# Altium schematic sheet MXChip.SchDoc
size A4; SheetNumber: 2; SheetTotal: 2
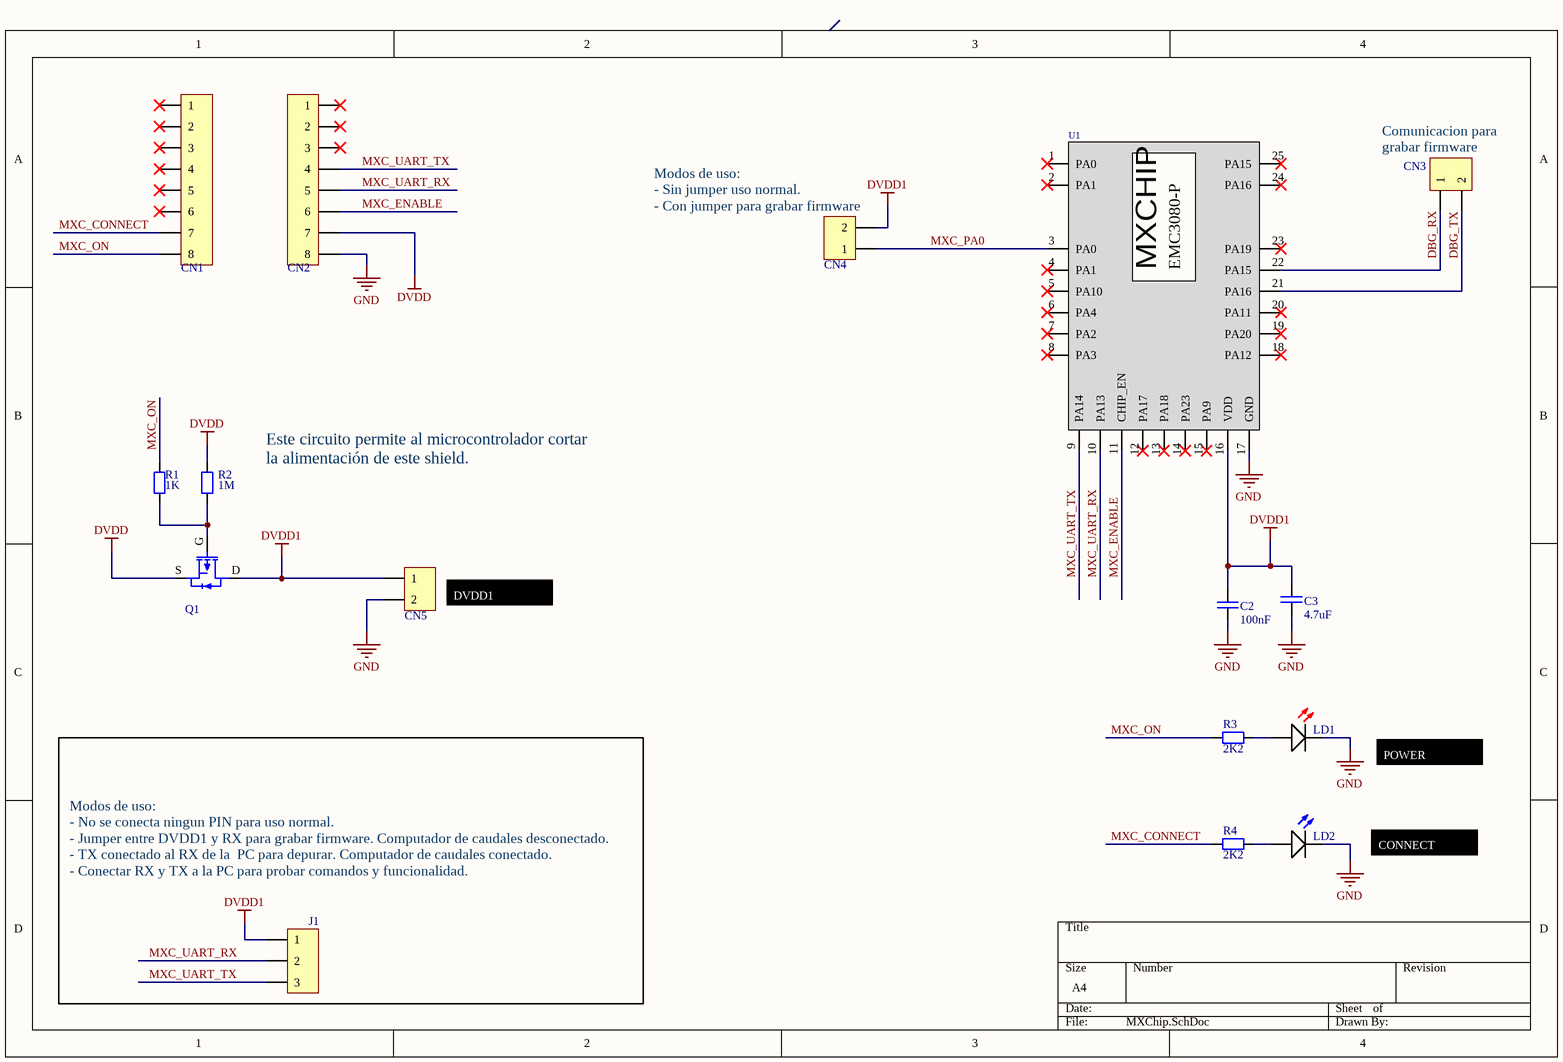
[diagram p0: MXChip.SchDoc]

## Parts
C2  100nF  [CAP_SM0805_YAGEOCC2_N]
C3  4.7uF  [CAP_SM0805_YAGEOCC2_N]
CN1  DEALON DZ200R-11-08-39  [HEADER PIN 1X8 2mm]  (value not drawn)
CN2  DEALON DZ200R-11-08-39  [HEADER PIN 1X8 2mm]  (value not drawn)
CN3  Completar BOM con modelo 54101-T0600LF (o equivalente), es de 36 posiciones, este componente necesita cortar 2 por componente  [HEADER PIN 1X2]  (value not drawn)
CN4  Completar BOM con modelo 54101-T0600LF (o equivalente), es de 36 posiciones, este componente necesita cortar 2 por componente  [HEADER PIN 1X2]  (value not drawn)
CN5  Completar BOM con modelo 54101-T0600LF (o equivalente), es de 36 posiciones, este componente necesita cortar 2 por componente  [HEADER PIN 1X2]  (value not drawn)
J1  Completar BOM con modelo 54101-T0600LF (o equivalente), es de 36 posiciones, este componente necesita cortar 3 por componente  [HEADER PIN 1X3]  (value not drawn)
LD1  ERROR  [LED 0805]  (value not drawn)
LD2  RUN  [LED 0805]  (value not drawn)
Q1  DMG3401LSN-7  [DMG3401LSN-7]  (value not drawn)
R1  1K  [RES_SM0805_YAGEORC_N]
R2  1M  [RES_SM0805_YAGEORC_N]
R3  2K2  [RES_SM0805_YAGEORC_N]
R4  2K2  [RES_SM0805_YAGEORC_N]
U1  EMC3080-P  [EMC3080-P]  (value not drawn)

## Nets
DVDD: CN2.7 Q1.S R2.2
DVDD1: C2.1 C3.1 CN4.2 CN5.1 J1.1 Q1.D U1.16(VDD)
GND: C2.2 C3.2 CN2.8 CN5.2 LD1.K LD2.K U1.17(GND)
DBG_RX: CN3.1 U1.22(PA15)
DBG_TX: CN3.2 U1.21(PA16)
MXC_CONNECT: CN1.7 R4.1
MXC_ENABLE: CN2.6 U1.11(CHIP_EN)
MXC_ON: CN1.8 R1.2 R3.1
MXC_PA0: CN4.1 U1.3(PA0)
MXC_UART_RX: CN2.5 J1.2 U1.10(PA13)
MXC_UART_TX: CN2.4 J1.3 U1.9(PA14)
NetLD1_A: LD1.A R3.2
NetLD2_A: LD2.A R4.2
NetQ1_G: Q1.G R1.1 R2.1

Not connected (* = marked no-connect by the designer): CN1 1* 2* 3* 4* 5* 6*; CN2 1* 2* 3*; U1 1(PA0)* 2(PA1)* 4(PA1)* 5(PA10)* 6(PA4)* 7(PA2)* 8(PA3)* 12(PA17)* 13(PA18)* 14(PA23)* 15(PA9)* 18(PA12)* 19(PA20)* 20(PA11)* 23(PA19)* 24(PA16)* 25(PA15)*

## Notes on the sheet
- (near CN3) Comunicacion para grabar firmware
- (near CN4) Modos de uso:
  - Sin jumper uso normal.
  - Con jumper para grabar firmware
- Este circuito permite al microcontrolador cortar la alimentación de este shield.
- (near CN5) DVDD1
- POWER
- Modos de uso:
  - No se conecta ningun PIN para uso normal.
  - Jumper entre DVDD1 y RX para grabar firmware. Computador de caudales desconectado.
  - TX conectado al RX de la  PC para depurar. Computador de caudales conectado.
  - Conectar RX y TX a la PC para probar comandos y funcionalidad.
- CONNECT

## Library data of the parts
C2 = CC0805KRX7R8BB104: CAP 100nF SM0805 X7R 25V YAGEO CC2; Tolerance (%): 10; Voltage Rating (Volts): 25; Category: Capacitor; Manufacturer: Yageo; Manufacturer Part Number: CC0805KRX7R8BB104; Package: 0805; Value: 100nF; Supplier Part Number 1: 644249; Supplier 1: Farnell; ComponentLink1URL: http://www.yageo.com; ComponentLink1Description: Manufacturer Website; Supplier 2: Digi-Key; Supplier Part Number 2: 311-1141-1-ND
C3 = CC0805KRX5R6BB475: CAP 4.7uF SM0805 X5R 10V YAGEO CC2; Tolerance (%): 10; Category: Capacitor; Manufacturer: Yageo; Manufacturer Part Number: CC0805KRX5R6BB475; Package: 0805; Value: 4.7uF; Supplier Part Number 1: 718671; Supplier 1: Farnell; ComponentLink1URL: http://www.yageo.com; ComponentLink1Description: Manufacturer Website; Voltage Rating (Volts): 10; Supplier 2: Digi-Key; Supplier Part Number 2: 311-1374-1-ND; Datasheet: https://datasheet.lcsc.com/lcsc/2304140030_YAGEO-CC0805KRX5R6BB475_C605218.pdf
CN1 CN2 = DEALON DZ200R-11-08-39: 1 x 8 - true hole  2mm - Pb free; Manufacturer: Amphenol ICC; Manufacturer Part Number: DZ200R-11-08-39; Category: Header pin; Datasheet: https://datasheet.lcsc.com/lcsc/2202082130_Amphenol-ICC-54101-T06-00_C213463.pdf; Temperature Max: 125; Temperature Min: -65
CN3-CN5 = 54101-T0600LF-CUT-2: 1 x 2 - true hole  2.54mm - Pb free; Manufacturer: Amphenol ICC; Equivalente: B-2100S02P-A110; Category: Header pin; Datasheet: https://datasheet.lcsc.com/lcsc/2202082130_Amphenol-ICC-54101-T06-00_C213463.pdf; Temperature Max: 125; Temperature Min: -65
J1 = 54101-T0600LF-CUT-3: 1 x 3 - true hole  2.54mm - Pb free; Manufacturer: Amphenol ICC; Manufacturer Part Number: 54101-T0600LF; Category: Header pin; Datasheet: https://datasheet.lcsc.com/lcsc/2202082130_Amphenol-ICC-54101-T06-00_C213463.pdf; Temperature Max: 125; Temperature Min: -65
LD1 = 17-21SURC/S530-A2/TR8: Manufacturer: Everlight Elec; Manufacturer Part Number: 17-21SURC/S530-A2/TR8; Category: LED; Main supplier: LCSC
LD2 = 17-21/BHC-XL2M2TY/3T: Manufacturer: Everlight Elec; Manufacturer Part Number: 17-21/BHC-XL2M2TY; Category: LED; Datasheet: https://datasheet.lcsc.com/lcsc/1809192317_Everlight-Elec-17-21-BHC-XL2M2TY-3T_C72035.pdf; Temperature Max: 85; Temperature Min: -40; Main supplier: LCSC
Q1 = DMG3401LSN-7: P-CHANNEL ENHANCEMENT MODE MOSFET / RDS(ON) = 85mΩ @ VGS = -2.5V -> ID -2.7A / V(BR)DDS 30V; Manufacturer: Diodes Incorporated; Category: Transistor mosfet; Manufacturer Part Number: DMG3401LSN-7; Datasheet: https://www.digikey.com/es/products/detail/diodes-incorporated/DMG3401LSN-7/3720138?s=N4IgTCBcDaICIFkDiBmALABgIwBkDKAcgLQDsIAugL5A
R1 = RC0805FR-071KL: RES 1K SM0805 YAGEO RC_L; Power (Watts): 0.125; Resistance (Ohms): 1000; Tolerance (%): 1; Category: Resistor; Manufacturer: Yageo; Manufacturer Part Number: RC0805FR-071KL; Package: 0805; Value: 1K; Supplier Part Number 1: 9237496; Supplier 1: Farnell; ComponentLink1URL: http://www.yageo.com; ComponentLink1Description: Manufacturer Website; Supplier 2: Digi-Key; Supplier Part Number 2: 311-1.00KCRCT-ND; Datasheet: https://www.yageo.com/upload/media/product/app/datasheet/rchip/pyu-rc_group_51_rohs_l.pdf
R2 = RC0805FR-071ML: RES 1M SM0805 YAGEO RC_L; Power (Watts): 0.125; Resistance (Ohms): 1000000; Tolerance (%): 1; Category: Resistor; Manufacturer: Yageo; Manufacturer Part Number: RC0805FR-071ML; Package: 0805; Value: 1M; Supplier Part Number 1: 9237992; Supplier 1: Farnell; ComponentLink1URL: http://www.yageo.com; ComponentLink1Description: Manufacturer Website; Supplier 2: Digi-Key; Supplier Part Number 2: 311-1.00MCRCT-ND; Datasheet: https://www.yageo.com/upload/media/product/productsearch/datasheet/rchip/PYu-RC_Group_51_RoHS_L_12.pdf
R3 R4 = RC0805FR-072K2L: RES 2K2 SM0805 YAGEO RC_L; Power (Watts): 0.125; Resistance (Ohms): 2200; Tolerance (%): 1; Category: Resistor; Manufacturer: Yageo; Manufacturer Part Number: RC0805FR-072K2L; Package: 0805; Value: 2K2; Supplier Part Number 1: 9237534; Supplier 1: Farnell; ComponentLink1Description: Manufacturer Website; ComponentLink1URL: http://www.yageo.com; Supplier 2: Digi-Key; Supplier Part Number 2: 311-2.20KCRCT-ND
U1 = EMC3080-P: Solamente es el zocalo donde va montado el chip, por eso no tiene modelo 3D; Manufacturer: MXCHIP; Manufacturer Part Number: EMC3080-P; Category: BLE Module; Datasheet: https://files.seeedstudio.com/products/113990975/EMC3080EN.pdf